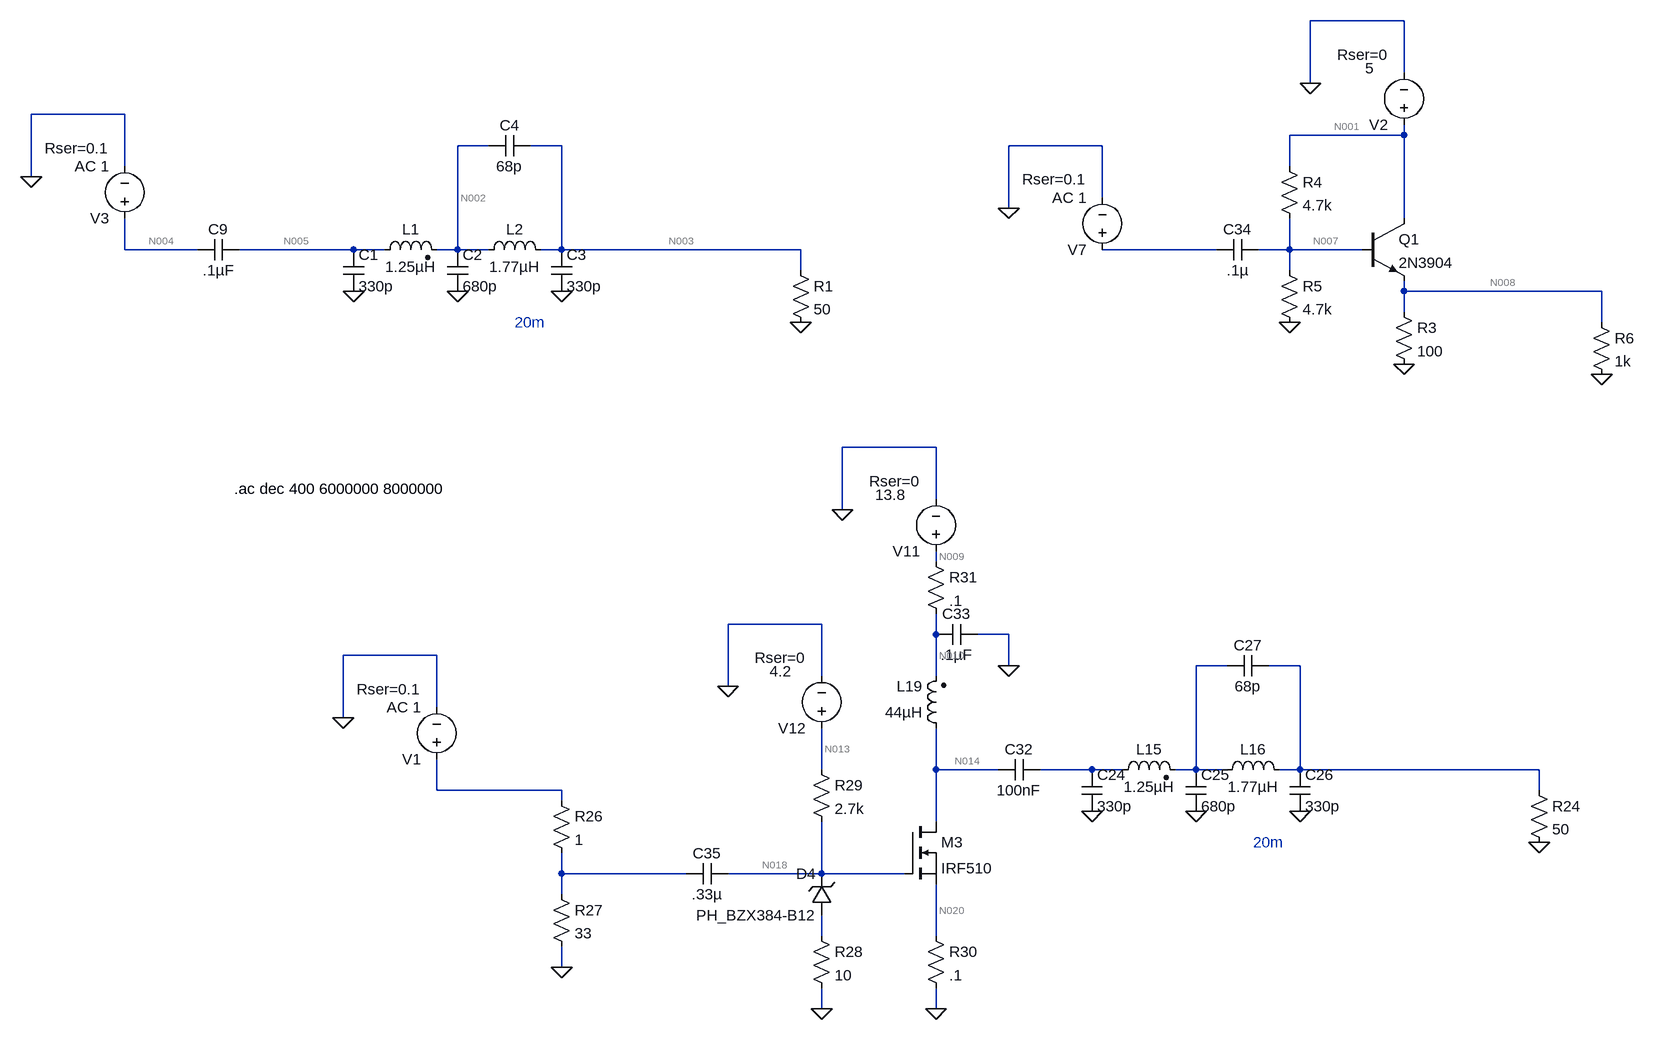
[diagram p0: schematic 10W IRF510 Amp 7 MHz - Impedance.asc]
10W IRF510 Amp 7 MHz - Impedance.asc, the LTspice schematic file:
Version 4
SHEET 1 3764 1240
WIRE 1136 -4208 992 -4208
WIRE 1136 -4128 1136 -4208
WIRE 992 -4112 992 -4208
WIRE -832 -4064 -976 -4064
WIRE 1136 -4032 1136 -4048
WIRE 1136 -4032 960 -4032
WIRE -272 -4016 -320 -4016
WIRE -160 -4016 -208 -4016
WIRE 672 -4016 528 -4016
WIRE -832 -3984 -832 -4064
WIRE 960 -3984 960 -4032
WIRE -976 -3968 -976 -4064
WIRE 672 -3936 672 -4016
WIRE 528 -3920 528 -4016
WIRE 1136 -3904 1136 -4032
WIRE -832 -3856 -832 -3904
WIRE -720 -3856 -832 -3856
WIRE -480 -3856 -656 -3856
WIRE -432 -3856 -480 -3856
WIRE -320 -3856 -320 -4016
WIRE -320 -3856 -352 -3856
WIRE -272 -3856 -320 -3856
WIRE -160 -3856 -160 -4016
WIRE -160 -3856 -192 -3856
WIRE 208 -3856 -160 -3856
WIRE 848 -3856 672 -3856
WIRE 960 -3856 960 -3904
WIRE 960 -3856 912 -3856
WIRE 1072 -3856 960 -3856
WIRE 208 -3824 208 -3856
WIRE 960 -3824 960 -3856
WIRE 1136 -3792 1136 -3808
WIRE 1440 -3792 1136 -3792
WIRE 1136 -3760 1136 -3792
WIRE 1440 -3744 1440 -3792
WIRE 416 -3552 272 -3552
WIRE 416 -3472 416 -3552
WIRE 272 -3456 272 -3552
WIRE 416 -3376 416 -3392
WIRE 240 -3280 96 -3280
WIRE 416 -3264 416 -3296
WIRE 528 -3264 480 -3264
WIRE -352 -3232 -496 -3232
WIRE 528 -3216 528 -3264
WIRE 864 -3216 816 -3216
WIRE 976 -3216 928 -3216
WIRE 240 -3200 240 -3280
WIRE 416 -3200 416 -3264
WIRE 96 -3184 96 -3280
WIRE -352 -3152 -352 -3232
WIRE -496 -3136 -496 -3232
WIRE 240 -3056 240 -3120
WIRE 416 -3056 416 -3120
WIRE 512 -3056 416 -3056
WIRE 656 -3056 576 -3056
WIRE 704 -3056 656 -3056
WIRE 816 -3056 816 -3216
WIRE 816 -3056 784 -3056
WIRE 864 -3056 816 -3056
WIRE 976 -3056 976 -3216
WIRE 976 -3056 944 -3056
WIRE 1344 -3056 976 -3056
WIRE -352 -3024 -352 -3072
WIRE -160 -3024 -352 -3024
WIRE 1344 -3024 1344 -3056
WIRE -160 -3008 -160 -3024
WIRE 416 -2976 416 -3056
WIRE -160 -2896 -160 -2928
WIRE 32 -2896 -160 -2896
WIRE 240 -2896 240 -2976
WIRE 240 -2896 96 -2896
WIRE 368 -2896 240 -2896
WIRE -160 -2864 -160 -2896
WIRE 240 -2800 240 -2832
WIRE 416 -2800 416 -2880
WIRE -160 -2752 -160 -2784
WIRE 240 -2688 240 -2720
WIRE 416 -2688 416 -2720
FLAG 528 -3920 0
FLAG 1344 -2944 0
FLAG 656 -2992 0
FLAG 816 -2992 0
FLAG 976 -2992 0
FLAG 272 -3456 0
FLAG 528 -3216 0
FLAG -160 -2752 0
FLAG 240 -2688 0
FLAG 416 -2688 0
FLAG 96 -3184 0
FLAG -496 -3136 0
FLAG 1136 -3680 0
FLAG 992 -4112 0
FLAG 960 -3744 0
FLAG 1440 -3664 0
FLAG -976 -3968 0
FLAG 208 -3744 0
FLAG -480 -3792 0
FLAG -320 -3792 0
FLAG -160 -3792 0
SYMBOL voltage 672 -3840 R180
WINDOW 123 24 96 Left 2
WINDOW 39 24 124 Left 2
WINDOW 3 46 103 Left 2
SYMATTR Value2 AC 1
SYMATTR SpiceLine Rser=0.1
SYMATTR Value ""
SYMATTR InstName V7
SYMBOL res 1328 -3040 R0
SYMATTR InstName R24
SYMATTR Value 50
SYMBOL cap 640 -3056 R0
SYMATTR InstName C24
SYMATTR Value 330p
SYMBOL cap 800 -3056 R0
SYMATTR InstName C25
SYMATTR Value 680p
SYMBOL cap 960 -3056 R0
SYMATTR InstName C26
SYMATTR Value 330p
SYMBOL ind2 688 -3040 R270
WINDOW 0 32 56 VTop 2
WINDOW 3 5 56 VBottom 2
SYMATTR InstName L15
SYMATTR Value 1.25µH
SYMATTR Type ind
SYMBOL ind 848 -3040 R270
WINDOW 0 32 56 VTop 2
WINDOW 3 5 56 VBottom 2
SYMATTR InstName L16
SYMATTR Value 1.77µH
SYMBOL cap 928 -3232 R90
WINDOW 0 0 32 VBottom 2
WINDOW 3 32 32 VTop 2
SYMATTR InstName C27
SYMATTR Value 68p
SYMBOL voltage 416 -3376 R180
WINDOW 123 0 0 Left 0
WINDOW 39 24 124 Left 2
WINDOW 3 46 103 Left 2
SYMATTR SpiceLine Rser=0
SYMATTR Value 13.8
SYMATTR InstName V11
SYMBOL ind2 432 -3104 R180
WINDOW 0 36 80 Left 2
WINDOW 3 36 40 Left 2
SYMATTR InstName L19
SYMATTR Value 44µH
SYMATTR Type ind
SYMBOL cap 576 -3072 R90
WINDOW 0 0 32 VBottom 2
WINDOW 3 32 32 VTop 2
SYMATTR InstName C32
SYMATTR Value 100nF
SYMBOL cap 480 -3280 R90
WINDOW 0 0 32 VBottom 2
WINDOW 3 32 32 VTop 2
SYMATTR InstName C33
SYMATTR Value .1µF
SYMBOL cap 912 -3872 R90
WINDOW 0 0 32 VBottom 2
WINDOW 3 32 32 VTop 2
SYMATTR InstName C34
SYMATTR Value .1µ
SYMBOL zener 256 -2832 R180
WINDOW 0 24 64 Left 2
WINDOW 3 24 0 Left 2
SYMATTR InstName D4
SYMATTR Value PH_BZX384-B12
SYMBOL res -176 -3024 R0
SYMATTR InstName R26
SYMATTR Value 1
SYMBOL res -176 -2880 R0
SYMATTR InstName R27
SYMATTR Value 33
SYMBOL cap 96 -2912 R90
WINDOW 0 0 32 VBottom 2
WINDOW 3 32 32 VTop 2
SYMATTR InstName C35
SYMATTR Value .33µ
SYMBOL res 224 -2816 R0
SYMATTR InstName R28
SYMATTR Value 10
SYMBOL nmos 368 -2976 R0
SYMATTR InstName M3
SYMATTR Value IRF510
SYMBOL res 224 -3072 R0
SYMATTR InstName R29
SYMATTR Value 2.7k
SYMBOL voltage 240 -3104 R180
WINDOW 123 0 0 Left 0
WINDOW 39 24 124 Left 2
WINDOW 3 46 103 Left 2
SYMATTR SpiceLine Rser=0
SYMATTR Value 4.2
SYMATTR InstName V12
SYMBOL res 400 -2816 R0
SYMATTR InstName R30
SYMATTR Value .1
SYMBOL res 400 -3392 R0
SYMATTR InstName R31
SYMATTR Value .1
SYMBOL voltage -352 -3056 R180
WINDOW 123 24 96 Left 2
WINDOW 39 24 124 Left 2
WINDOW 3 46 103 Left 2
SYMATTR Value2 AC 1
SYMATTR SpiceLine Rser=0.1
SYMATTR Value ""
SYMATTR InstName V1
SYMBOL npn 1072 -3904 R0
SYMATTR InstName Q1
SYMATTR Value 2N3904
SYMBOL res 1120 -3776 R0
SYMATTR InstName R3
SYMATTR Value 100
SYMBOL voltage 1136 -4032 R180
WINDOW 123 0 0 Left 0
WINDOW 39 24 124 Left 2
WINDOW 3 46 103 Left 2
SYMATTR SpiceLine Rser=0
SYMATTR Value 5
SYMATTR InstName V2
SYMBOL res 944 -4000 R0
SYMATTR InstName R4
SYMATTR Value 4.7k
SYMBOL res 944 -3840 R0
SYMATTR InstName R5
SYMATTR Value 4.7k
SYMBOL res 1424 -3760 R0
SYMATTR InstName R6
SYMATTR Value 1k
SYMBOL voltage -832 -3888 R180
WINDOW 123 24 96 Left 2
WINDOW 39 24 124 Left 2
WINDOW 3 46 103 Left 2
SYMATTR Value2 AC 1
SYMATTR SpiceLine Rser=0.1
SYMATTR Value ""
SYMATTR InstName V3
SYMBOL cap -656 -3872 R90
WINDOW 0 0 32 VBottom 2
WINDOW 3 32 32 VTop 2
SYMATTR InstName C9
SYMATTR Value .1µF
SYMBOL res 192 -3840 R0
SYMATTR InstName R1
SYMATTR Value 50
SYMBOL cap -496 -3856 R0
SYMATTR InstName C1
SYMATTR Value 330p
SYMBOL cap -336 -3856 R0
SYMATTR InstName C2
SYMATTR Value 680p
SYMBOL cap -176 -3856 R0
SYMATTR InstName C3
SYMATTR Value 330p
SYMBOL ind2 -448 -3840 R270
WINDOW 0 32 56 VTop 2
WINDOW 3 5 56 VBottom 2
SYMATTR InstName L1
SYMATTR Value 1.25µH
SYMATTR Type ind
SYMBOL ind -288 -3840 R270
WINDOW 0 32 56 VTop 2
WINDOW 3 5 56 VBottom 2
SYMATTR InstName L2
SYMATTR Value 1.77µH
SYMBOL cap -208 -4032 R90
WINDOW 0 0 32 VBottom 2
WINDOW 3 32 32 VTop 2
SYMATTR InstName C4
SYMATTR Value 68p
TEXT 904 -2944 Left 2 ;20m
TEXT -664 -3488 Left 2 !.ac dec 400 6000000 8000000
TEXT -232 -3744 Left 2 ;20m

The netlist it stands for:
* 10W IRF510 Amp 7 MHz - Impedance.asc
V7 N006 0 AC 1 Rser=0.1
R24 N012 0 50
C24 N015 0 330p
C25 N011 0 680p
C26 N012 0 330p
L15 N015 N011 1.25µH
L16 N011 N012 1.77µH
C27 N012 N011 68p
V11 N009 0 13.8 Rser=0
L19 N014 N010 44µH
C32 N015 N014 100nF
C33 0 N010 .1µF
C34 N007 N006 .1µ
D4 N019 N018 PH_BZX384-B12
R26 N016 N017 1
R27 N017 0 33
C35 N018 N017 .33µ
R28 N019 0 10
M3 N014 N018 N020 N020 IRF510
R29 N013 N018 2.7k
V12 N013 0 4.2 Rser=0
R30 N020 0 .1
R31 N009 N010 .1
V1 N016 0 AC 1 Rser=0.1
Q1 N001 N007 N008 0 2N3904
R3 N008 0 100
V2 N001 0 5 Rser=0
R4 N001 N007 4.7k
R5 N007 0 4.7k
R6 N008 0 1k
V3 N004 0 AC 1 Rser=0.1
C9 N005 N004 .1µF
R1 N003 0 50
C1 N005 0 330p
C2 N002 0 680p
C3 N003 0 330p
L1 N005 N002 1.25µH
L2 N002 N003 1.77µH
C4 N003 N002 68p
.model D D
.lib standard.dio
.model NPN NPN
.model PNP PNP
.lib standard.bjt
.model NMOS NMOS
.model PMOS PMOS
.lib standard.mos
* 20m
.ac dec 400 6000000 8000000
* 20m
.backanno
.end

* Results of the author's LTspice run, read from the files saved beside the schematic
* Operating Point, zero values left out:
*   V(n009) = 13.8 V
*   V(n014) = 13.79 V
*   V(n010) = 13.79 V
*   V(n007) = 2.358 V
*   V(n018) = 4.2 V
*   V(n020) = 10.97 mV
*   V(n013) = 4.2 V
*   V(n001) = 5 V
*   V(n008) = 1.625 V
*   Ic(Q1) = 17.82 mA
*   Ib(Q1) = 60.37 µA
*   Ie(Q1) = -17.88 mA
*   Id(M3) = 109.7 mA
*   Ig(M3) = -88.91 pA
*   Is(M3) = -109.7 mA
*   I(D4) = -4.211 pA
*   I(L19) = -109.7 mA
*   I(R6) = 1.625 mA
*   I(R5) = 501.7 µA
*   I(R4) = 562.1 µA
*   I(R3) = 16.25 mA
*   I(R31) = 109.7 mA
*   I(R30) = 109.7 mA
*   I(R29) = 4.211 pA
*   I(R28) = 4.211 pA
*   I(V2) = -18.38 mA
*   I(V12) = -4.211 pA
*   I(V11) = -109.7 mA
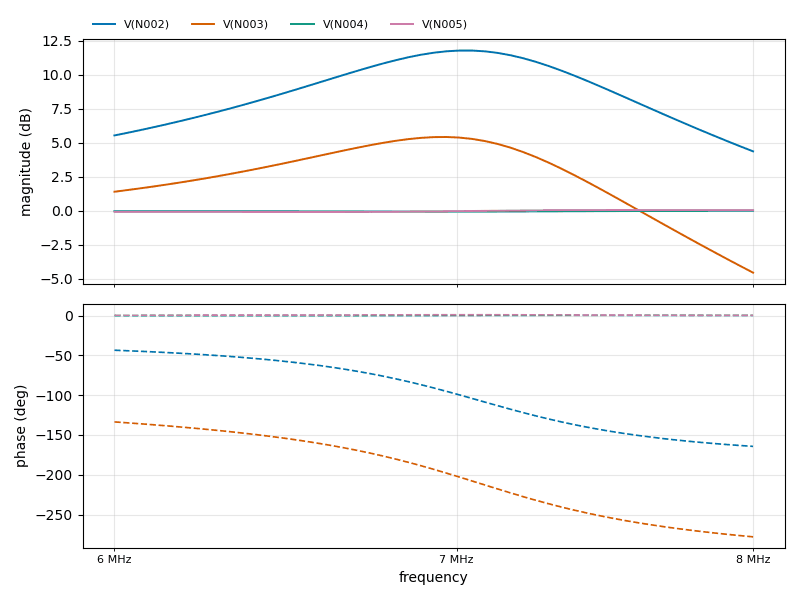
[diagram p1: AC Analysis of 10W IRF510 Amp 7 MHz - Impedance.asc, plotted from the saved traces]
* AC Analysis, 1 run:
*   V(N002): 5.54 dB at 6 MHz, 4.37 dB at 8 MHz, peak 11.78 dB at 7.009 MHz, 3 dB below the peak at 6.492 MHz and 7.507 MHz
*   V(N003): 1.40 dB at 6 MHz, -4.55 dB at 8 MHz, peak 5.42 dB at 6.969 MHz, 3 dB below the peak at 6.257 MHz and 7.399 MHz
*   V(N004): -0.02 dB at 6 MHz, -0.01 dB at 8 MHz, peak -0.01 dB at 8 MHz
*   V(N005): -0.07 dB at 6 MHz, 0.04 dB at 8 MHz, peak 0.05 dB at 7.51 MHz